# Altium schematic sheet v1.5 IMU & Baro.SchDoc
size A4; DocumentNumber: 6; SheetNumber: 6
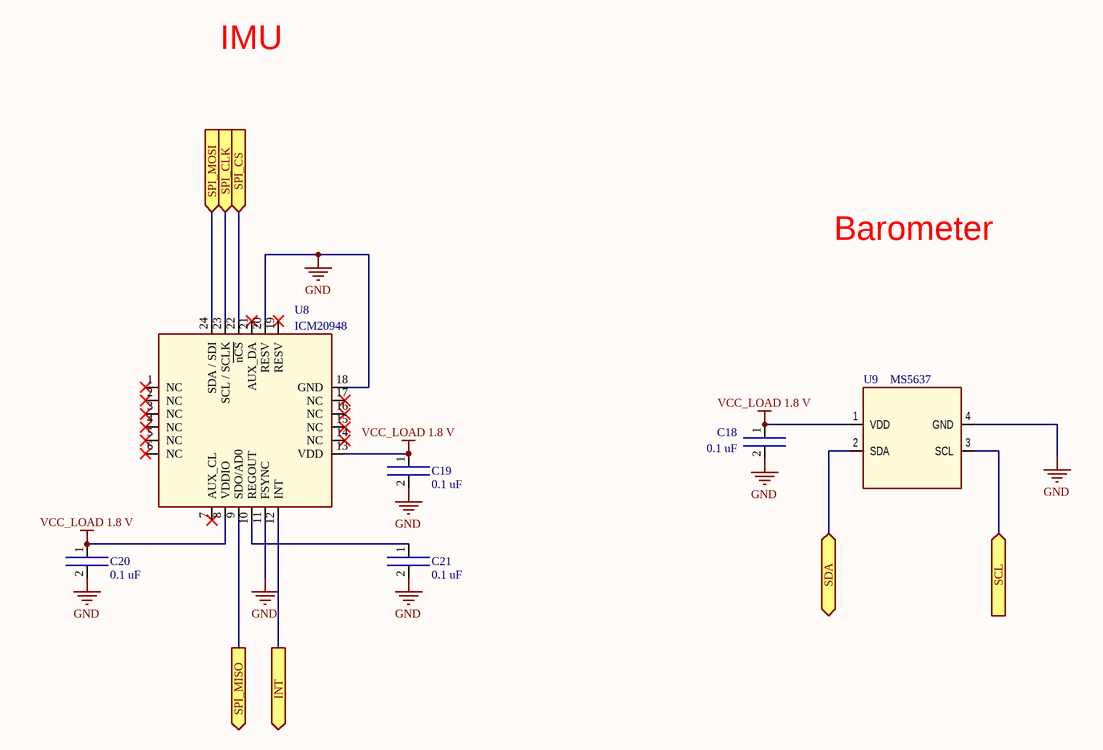
[diagram p0: v1.5 IMU & Baro.SchDoc]

## Parts
C18  0.1 uF  [0402]
C19  0.1 uF  [0402]
C20  0.1 uF  [0402]
C21  0.1 uF  [0402]
U8  ICM20948  [ICM20948]
U9  MS5637  [MS5637-02BA03]

## Ports
INT (out), SCL (in), SDA (bidir), SPI_CLK (in), SPI_CS (in), SPI_MISO (out), SPI_MOSI (in)

## Nets
GND: C18.2 C19.2 C20.2 C21.2 U8.11(FSYNC) U8.18(GND) U8.20(RESV) U9.4(GND)
VCC_LOAD 1.8 V: C18.1 C19.1 C20.1 U8.8(VDDIO) U8.13(VDD) U9.1(VDD)
INT: U8.12(INT) ; port INT
SCL: U9.3(SCL) ; port SCL
SDA: U9.2(SDA) ; port SDA
SPI_CLK: U8.23(SCL_/_SCLK) ; port SPI_CLK
SPI_CS: U8.22(~{nCS}) ; port SPI_CS
SPI_MISO: U8.9(SDO/AD0) ; port SPI_MISO
SPI_MOSI: U8.24(SDA_/_SDI) ; port SPI_MOSI
NetC21_1: C21.1 U8.10(REGOUT)

Not connected (* = marked no-connect by the designer): U8 1(NC)* 2(NC)* 3(NC)* 4(NC)* 5(NC)* 6(NC)* 7(AUX_CL)* 14(NC)* 15(NC)* 16(NC)* 17(NC)* 19(RESV)* 21(AUX_DA)*

## Notes on the sheet
- IMU
- Barometer

## Library data of the parts
C18-C21 = Capasistor
U9 = MS5637-02BA03